# Altium schematic sheet PDN.SchDoc
size A4; SheetNumber: 3; SheetTotal: 12
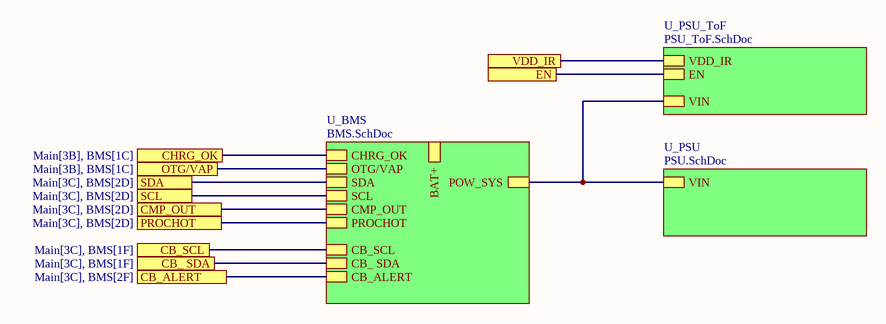
[diagram p0: PDN.SchDoc]

## Sub-sheets
U_BMS = BMS.SchDoc: CHRG_OK, OTG/VAP, SDA, SCL, CMP_OUT, PROCHOT, CB_SCL, CB_ SDA, CB_ALERT, BAT+, POW_SYS
U_PSU = PSU.SchDoc: VIN
U_PSU_ToF = PSU_ToF.SchDoc: VIN, VDD_IR, EN

## Ports
CB_ SDA (see Main[3C], BMS[1F]), CB_ALERT (see Main[3C], BMS[2F]), CB_SCL (see Main[3C], BMS[1F]), CHRG_OK (see Main[3B], BMS[1C]), CMP_OUT (see Main[3C], BMS[2D]), EN, OTG/VAP (see Main[3B], BMS[1C]), PROCHOT (see Main[3C], BMS[2D]), SCL (see Main[3C], BMS[2D]), SDA (see Main[3C], BMS[2D]), VDD_IR

## Nets
CB_ SDA: port CB_ SDA, sheet U_BMS/CB_ SDA
CB_ALERT: port CB_ALERT, sheet U_BMS/CB_ALERT
CB_SCL: port CB_SCL, sheet U_BMS/CB_SCL
CHRG_OK: port CHRG_OK, sheet U_BMS/CHRG_OK
CMP_OUT: port CMP_OUT, sheet U_BMS/CMP_OUT
EN: port EN, sheet U_PSU_ToF/EN
OTG/VAP: port OTG/VAP, sheet U_BMS/OTG/VAP
PROCHOT: port PROCHOT, sheet U_BMS/PROCHOT
SCL: port SCL, sheet U_BMS/SCL
SDA: port SDA, sheet U_BMS/SDA
VDD_IR: port VDD_IR, sheet U_PSU_ToF/VDD_IR
(unnamed): sheet U_PSU/VIN, sheet U_BMS/POW_SYS, sheet U_PSU_ToF/VIN